# Altium project FLEXI_HAL_Quark.PrjPCB (part 1 of 5)
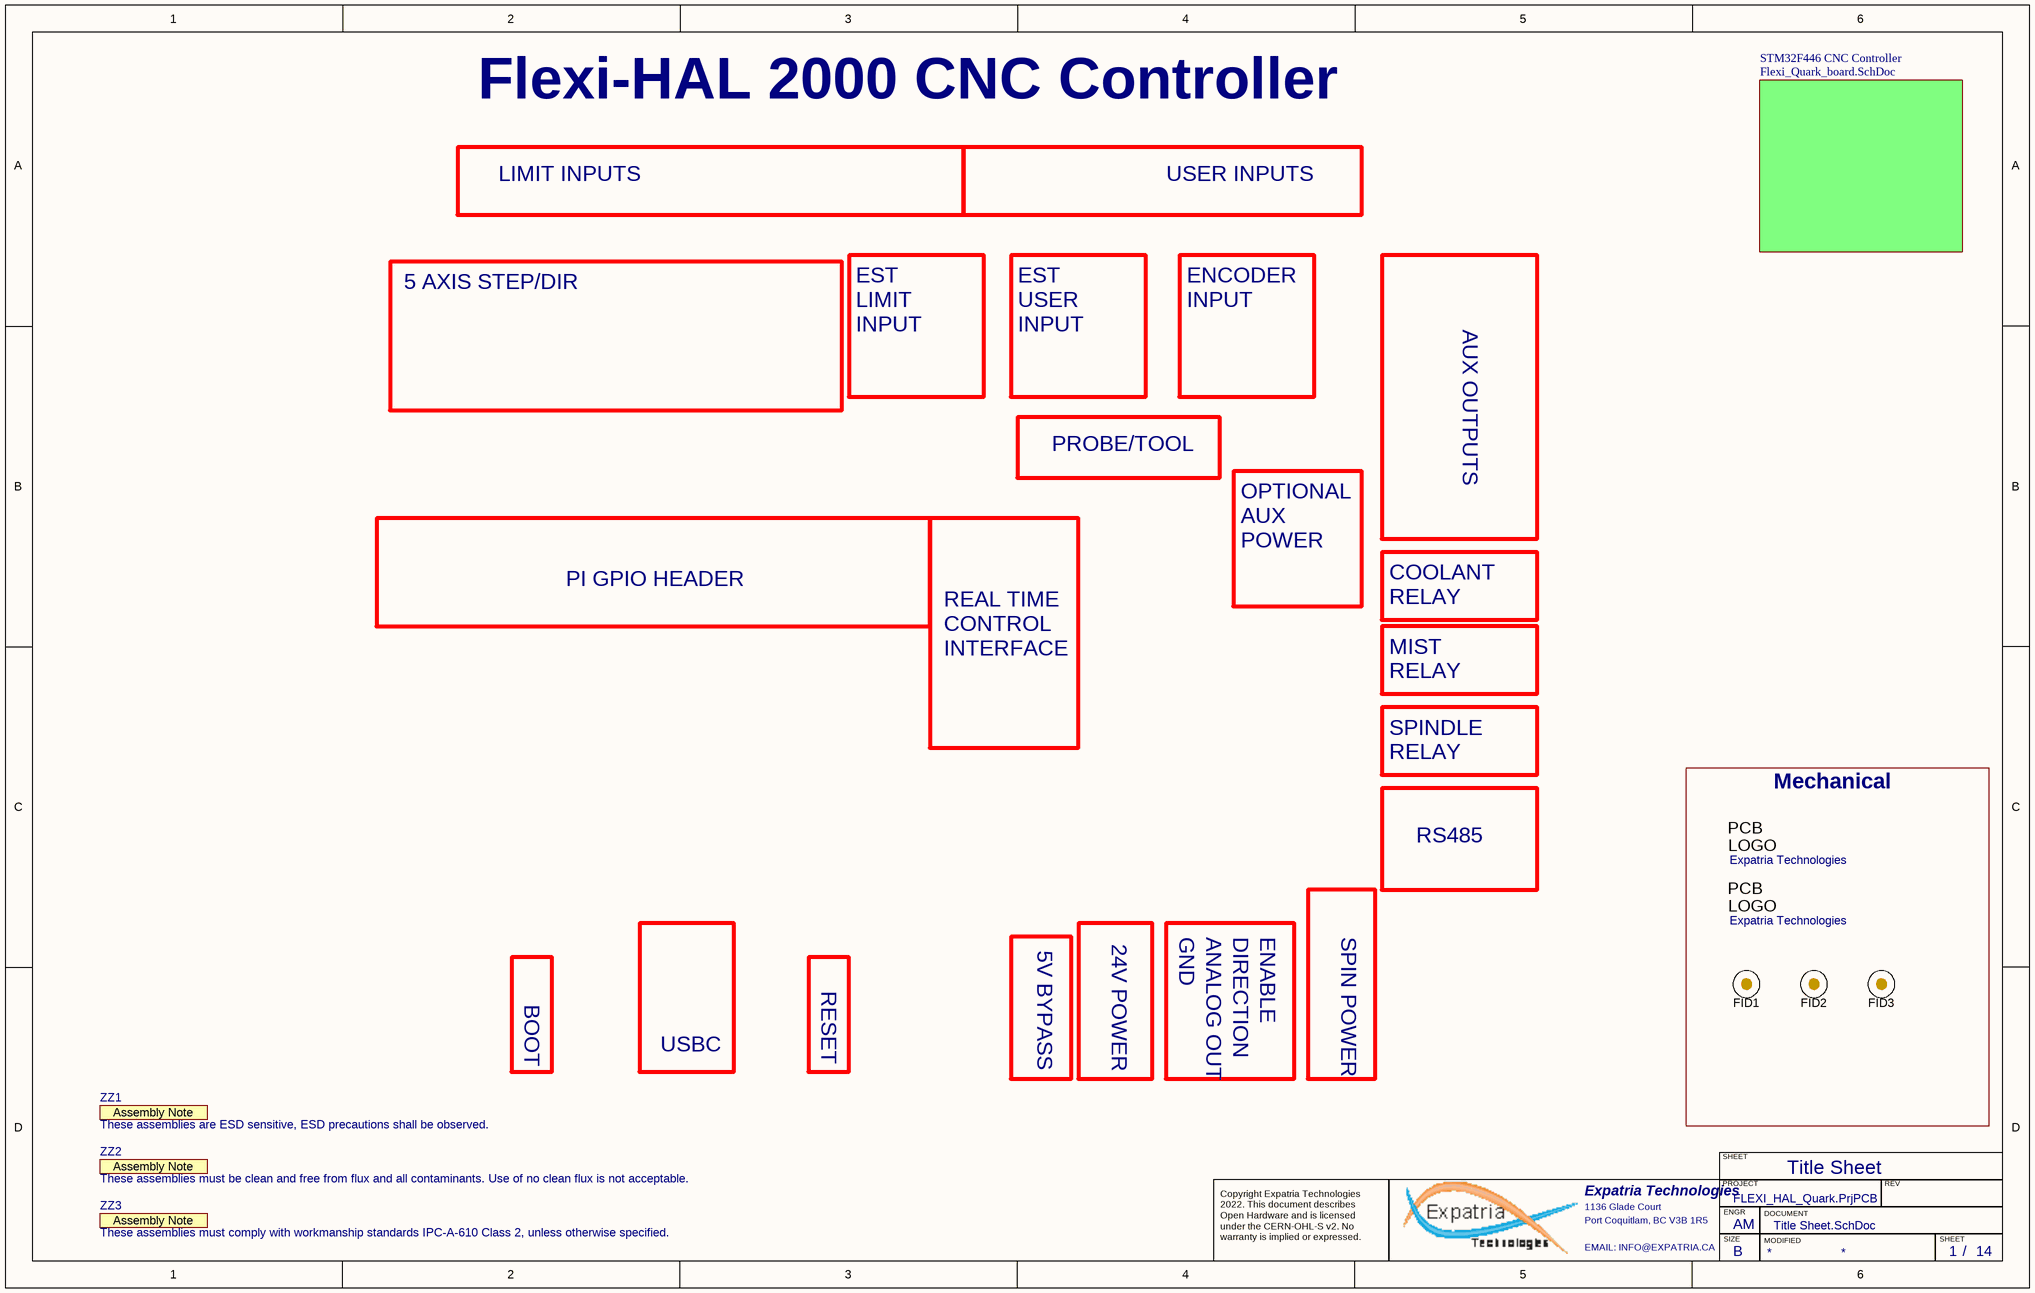
[diagram p0: Title Sheet.SchDoc]
PCBPARTNO: FlexiHAL-STP; PCBREVNO: A1; Title: FlexiHAL-STP; VarRevNo: A1
22 sheets, 771 parts. Net scope: hierarchical (ports join the sheet entries above them; power ports are global).
Board file: FLEXI_HAL_Quark.pcbdoc
Sheets:
  Title Sheet.SchDoc
    STM32F446 CNC Controller = Flexi_Quark_board.SchDoc
      ST = Stepper_driver_group.SchDoc
        SX = Stepper_Driver_Quark.SchDoc
        SY = Stepper_Driver_Quark.SchDoc
        SZ = Stepper_Driver_Quark.SchDoc
        SA = Stepper_Driver_Quark.SchDoc
        SB = Stepper_Driver_Quark.SchDoc
        SC = Stepper_Driver_Quark.SchDoc
        AO = 2CH_Digital_Isolator.SchDoc
        AO = 2CH_Digital_Isolator.SchDoc
      MODBUS = RS485.SchDoc
        RS = 2DIR_Digital_Isolator.SchDoc
      Microcontroller = MCU_STM32H723ZGT6.SchDoc
        Ethernet = Ethernet_Interface.SchDoc
        USB ULPI = USB_ULPI_Interface.SchDoc
      5V_Supply = 5V_Power_Supply.SchDoc
      12V_Supply = 12V_Power_Supply.SchDoc
      Pendant RT Interface = CANBUS_Pendant.SchDoc
        CB = 2DIR_Digital_Isolator.SchDoc
      4 Encoder Inputs = Encoder_Input.SchDoc
        U_ENC0 = Encoder_RJ45.SchDoc
        U_ENC1 = Encoder_RJ45.SchDoc
        U_ENC2 = Encoder_RJ45.SchDoc
        U_ENC3 = Encoder_RJ45.SchDoc
        EI = 2CH_Digital_Isolator.SchDoc
        EI = 2CH_Digital_Isolator.SchDoc
        EI = 2CH_Digital_Isolator.SchDoc
        EI = 2CH_Digital_Isolator.SchDoc
        EI = 2CH_Digital_Isolator.SchDoc
        EI = 2CH_Digital_Isolator.SchDoc
      SERIAL_EXP = Serial_Expansion.SchDoc
      Mezzanine Connector = Mezz_connector.SchDoc
        LIM_SW = Limit_Switches.SchDoc
          PH_DR = Photocoupler12Vinput.SchDoc
          PH_DR = Photocoupler12Vinput.SchDoc
          PH_DR = Photocoupler12Vinput.SchDoc
          PH_DR = Photocoupler12Vinput.SchDoc
          PH_DR = Photocoupler12Vinput.SchDoc
          PH_DR = Photocoupler12Vinput.SchDoc
        USR_SW = Misc_switches.SchDoc
          PH_CY = Photocoupler12Vinput.SchDoc
          PH_FD = Photocoupler12Vinput.SchDoc
          PH_DR = Photocoupler12Vinput.SchDoc
          PH_TL = Photocoupler12Vinput.SchDoc
          PH_PR = Photocoupler12Vinput.SchDoc
        AUX_I = Aux_Inputs.SchDoc
          AI = 2CH_Digital_Isolator.SchDoc
          AI = 2CH_Digital_Isolator.SchDoc
        MZ = 2CH_Digital_Isolator.SchDoc
        MZ = 2CH_Digital_Isolator.SchDoc
        MZ = 2CH_Digital_Isolator.SchDoc
        MZ = 2CH_Digital_Isolator.SchDoc
        MZ = 2CH_Digital_Isolator.SchDoc
        MZ = 2CH_Digital_Isolator.SchDoc
      PH_HLT = 2xparallelswitch_HALT.SchDoc

## Sheet Title Sheet.SchDoc: STM32F446 CNC
size B; Author: AM; CompanyName: Expatria Technologies; DrawnBy: A.Marles; Engineer: AM; Organization: Expatria Technolgoies; DocumentNumber: 1; Revision: A1; SheetNumber: 1; SheetTotal: 14

### Parts
FID1  Fiducial  [Fiducial10-20]  (value not drawn)  (no BOM)
FID2  Fiducial  [Fiducial10-20]  (value not drawn)  (no BOM)
FID3  Fiducial  [Fiducial10-20]  (value not drawn)  (no BOM)
Logo1  Expatria Technologies  [Expatria-Logo]  (no BOM)
Logo2  Expatria Technologies  [Expatria-Logo]  (no BOM)
ZZ1  These assemblies are ESD sensitive, ESD precautions shall be observed.  [AssemblyNote]  (graphical)
ZZ2  These assemblies must be clean and free from flux and all contaminants. Use of no clean flux is not acceptable.  [AssemblyNote]  (graphical)
ZZ3  These assemblies must comply with workmanship standards IPC-A-610 Class 2, unless otherwise specified.  [AssemblyNote]  (graphical)

### Blocks framed on the sheet
Mechanical: FID1-FID3 Logo1 Logo2

### Sub-sheets
STM32F446 CNC Controller = Flexi_Quark_board.SchDoc: no entries

### Notes on the sheet
- Flexi-HAL 2000 CNC Controller
- LIMIT INPUTS
- USER INPUTS
- 5 AXIS STEP/DIR
- EST
  LIMIT
  INPUT
- EST
  USER
  INPUT
- ENCODER
  INPUT
- AUX OUTPUTS
- PROBE/TOOL
- OPTIONAL
  AUX
  POWER
- PI GPIO HEADER
- COOLANT
  RELAY
- MIST
  RELAY
- SPINDLE
  RELAY
- REAL TIME CONTROL INTERFACE
- RS485
- 5V BYPASS
- 24V POWER
- GND
- ANALOG OUT
- DIRECTION
- ENABLE
- SPIN POWER
- BOOT
- RESET
- USBC
- Title Sheet
- SHEET
- Expatria Technologies
- 1136 Glade Court
- Port Coquitlam, BC V3B 1R5
- PROJECT
- SIZE
- ENGR
- MODIFIED
- DOCUMENT
- REV
- Copyright Expatria Technologies 2022. This document describes Open Hardware and is licensed under the CERN-OHL-S v2. No warranty is implied or expressed.
- EMAIL: INFO@EXPATRIA.CA
- B
- /
- (in symbol AssemblyNote) Assembly Note
- (in symbol SBT-Logo) PCB; LOGO

### Library data of the parts
FID1-FID3 = Fiducial: FIDUCIAL NO ASSEMBLY; Manufacturer 1: NONE; Manufacturer Part Number 1: NONE; Value: Fiducial
Logo1 Logo2 = SBT-Logo: Manufacturer 1: NONE; Value: Expatria Logo; Manufacturer Part Number 1: NONE
ZZ1-ZZ3 = AssemblyNote: SymbolCreator: codlsc; SymbolVersion: 2010-05-18; CompType: AssemblyNote; ClassName: AssemblyNote; Publisher: Texas Instruments; LatestRevisionDate: 2012-06-14; LatestRevisionNote: Initial Version; Alternate Manufacturer: -; Alternate PartNumber: -; Parameter 1: *

## Sheet Flexi_Quark_board.SchDoc: RP2040 CNC
size C; Author: AM; CompanyName: Expatria Technologies; DrawnBy: A.Marles; Engineer: AM; Organization: Expatria Technolgoies; Address1: Schematic; DocumentNumber: 2; Revision: A1; SheetNumber: 2; SheetTotal: 14
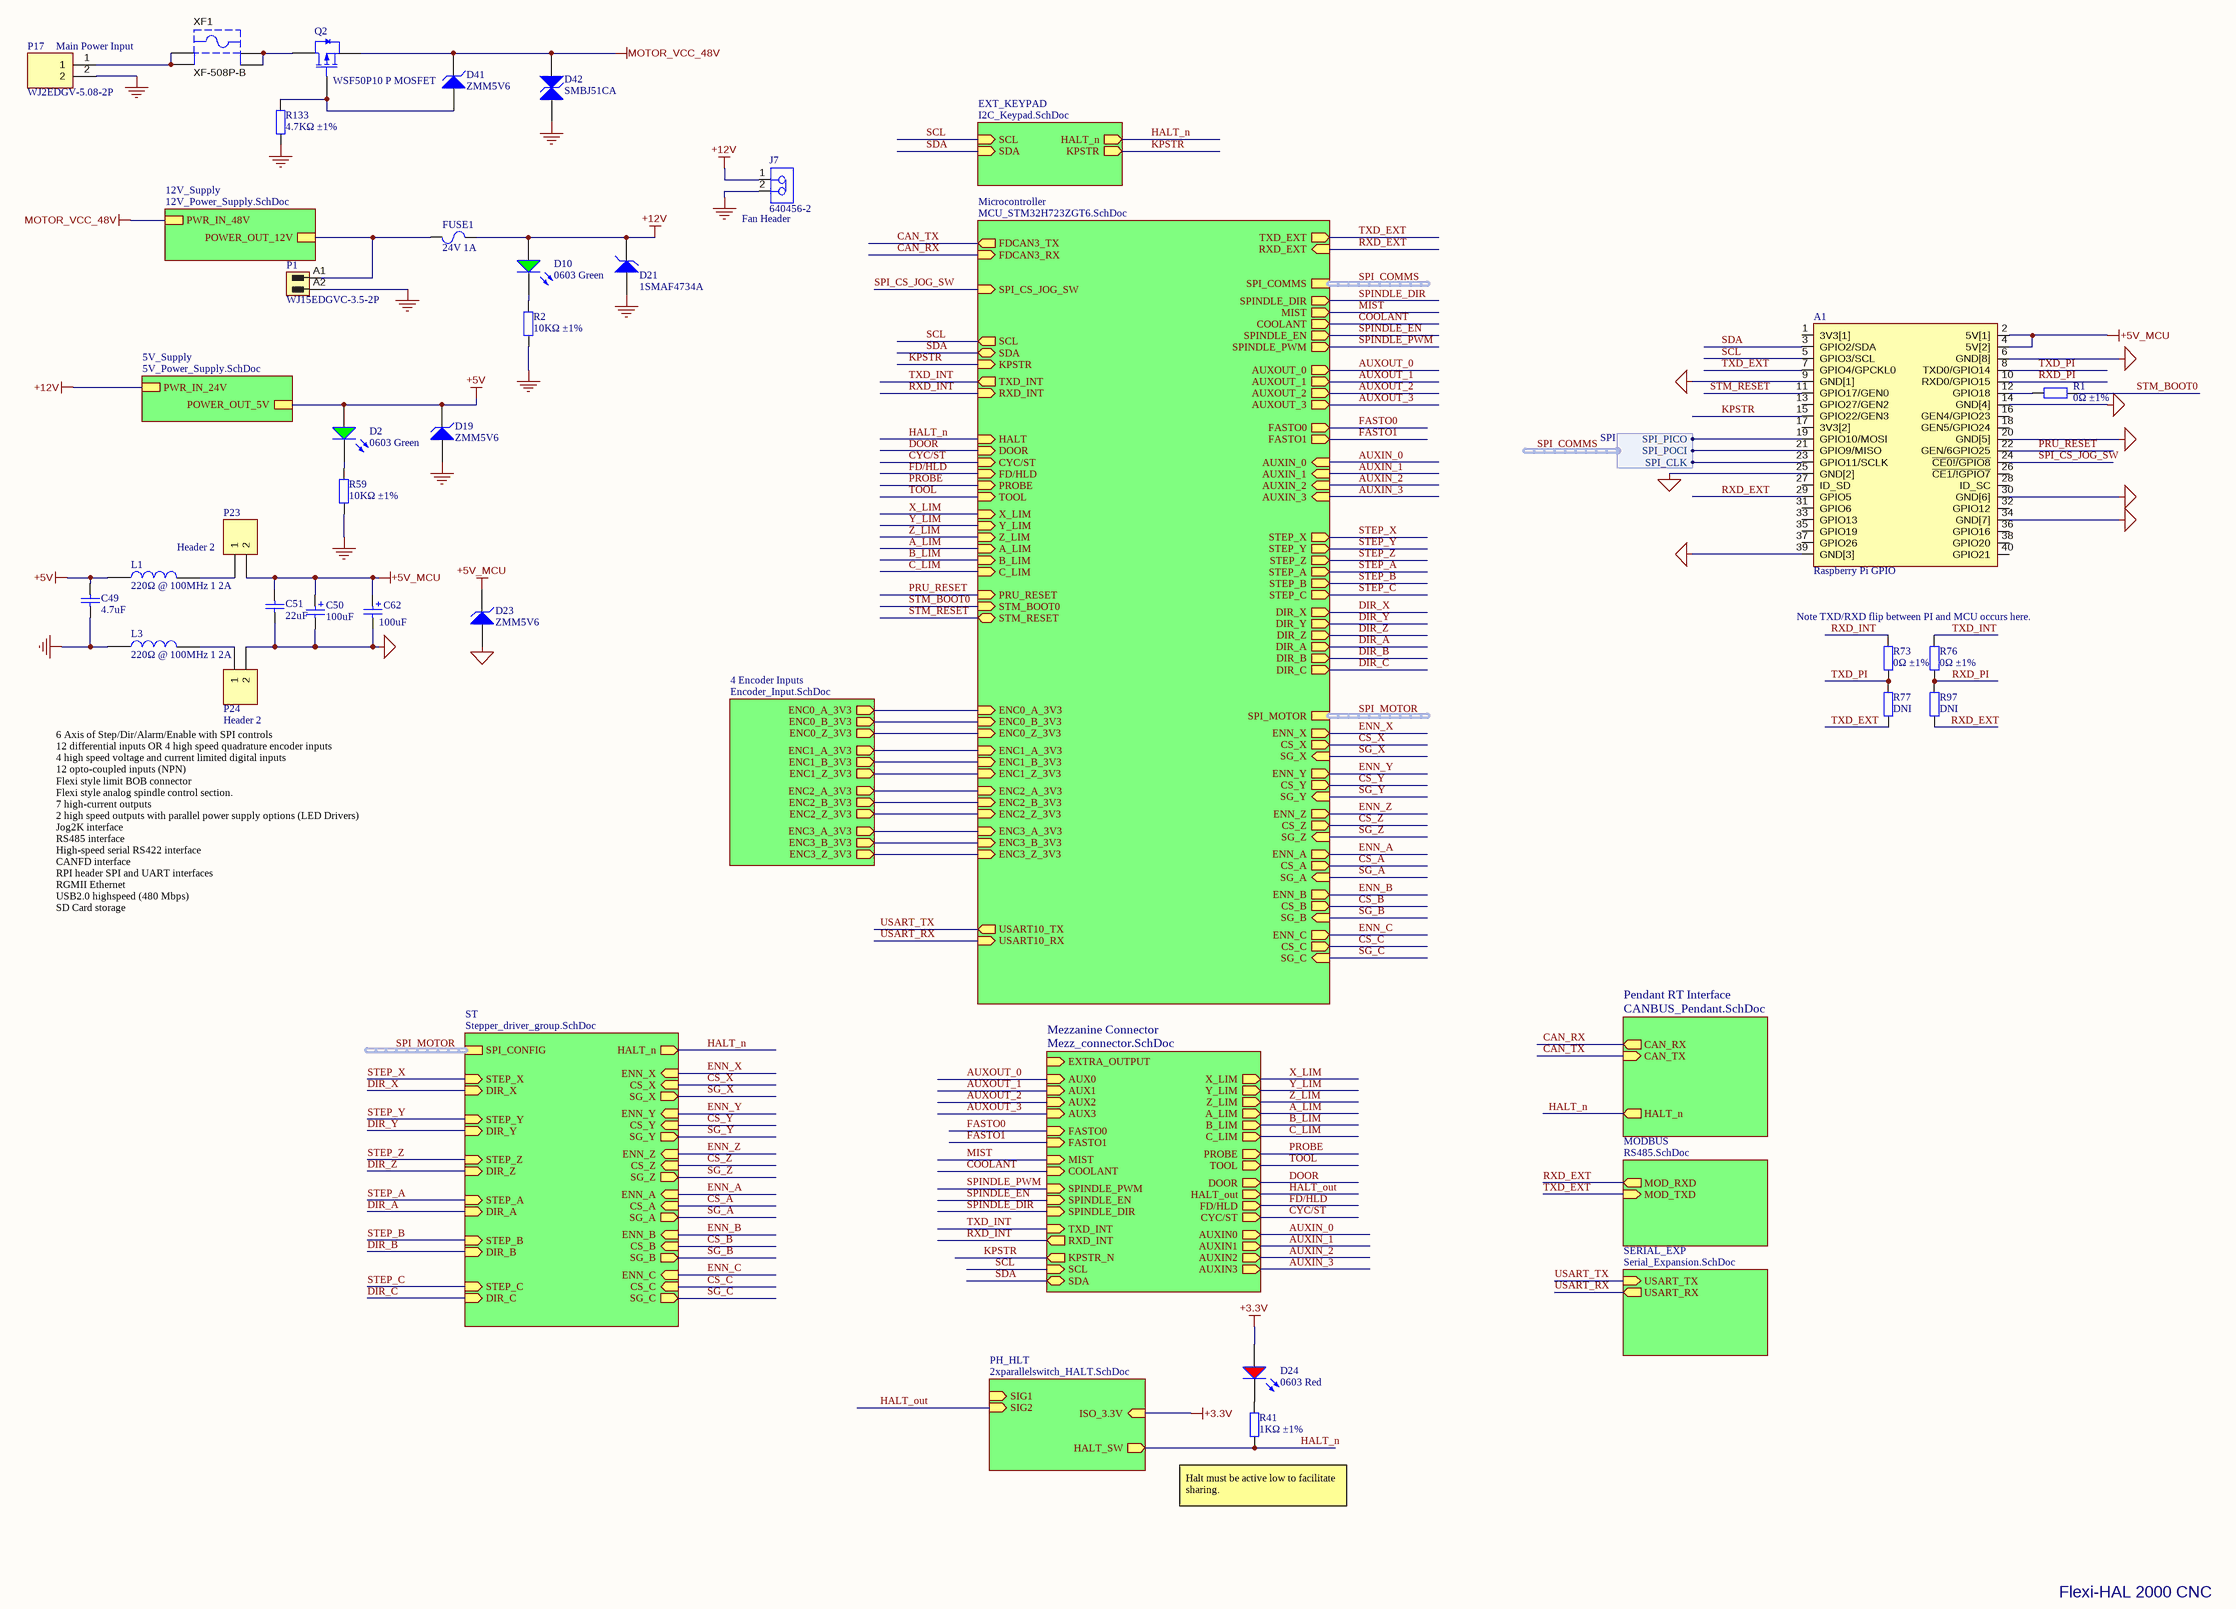
[diagram p1: Flexi_Quark_board.SchDoc]

### Parts
A1  Raspberry Pi GPIO  [MODULE_RASPBERRY_PI_4_MODEL_B]
C49  4.7uF  [0603_C]
C50  100uF  [CASE-B_3528]
C51  22uF  [0805_C]
C62  100uF  [WCAP-ASLI_D6.3H7.7]
D2  0603 Green  [0603_LED_S1]
D10  0603 Green  [0603_LED_S1]
D19  ZMM5V6  [LL-34]
D21  1SMAF4734A  [DIOM5226X240N]
D23  ZMM5V6  [LL-34]
D24  0603 Red  [0603_LED_S1]
D41  ZMM5V6  [LL-34]
D42  SMBJ51CA  [SMB(DO-214AA)_S1]
FUSE1  24V 1A  [1206_C]
J7  640456-2  [TECO-640456-2_V]
L1  220Ω @ 100MHz 1 2A  [0805_C]
L3  220Ω @ 100MHz 1 2A  [0805_C]
P1  WJ15EDGVC-3.5-2P  [691321100002]
P17  WJ2EDGV-5.08-2P  [WJ2EDGV5082P]
P23  Header 2  [HDR1X2]
P24  Header 2  [HDR1X2]
Q2  WSF50P10 P MOSFET  [TO-252-2-180]
R1  0Ω ±1%  [0603_R]
R2  10KΩ ±1%  [0603_R]
R41  1KΩ ±1%  [0603_R]
R59  10KΩ ±1%  [0603_R]
R73  0Ω ±1%  [0402_R]
R76  0Ω ±1%  [0402_R]
R77  DNI  [0402_R]  (no BOM)
R97  DNI  [0402_R]  (no BOM)
R133  4.7KΩ ±1%  [0603_R]
XF1  XF-508P-B  [KSTN-3568_V]

### Sub-sheets
4 Encoder Inputs = Encoder_Input.SchDoc: ENC0_B_3V3 (out), ENC1_Z_3V3 (out), ENC0_Z_3V3 (out), ENC2_Z_3V3 (out), ENC3_Z_3V3 (out), ENC1_B_3V3 (out), ENC0_A_3V3 (out), ENC1_A_3V3 (out), ENC3_A_3V3 (out), ENC3_B_3V3 (out), ENC2_B_3V3 (out), ENC2_A_3V3 (out)
5V_Supply = 5V_Power_Supply.SchDoc: POWER_OUT_5V, PWR_IN_24V
12V_Supply = 12V_Power_Supply.SchDoc: POWER_OUT_12V, PWR_IN_48V
EXT_KEYPAD = I2C_Keypad.SchDoc (file not in this document): HALT_n (out), SCL (in), KPSTR (out), SDA (in)
Mezzanine Connector = Mezz_connector.SchDoc: Y_LIM (out), Z_LIM (out), X_LIM (out), A_LIM (out), B_LIM (out), C_LIM (out), PROBE (out), TOOL (out), FD/HLD (out), CYC/ST (out), HALT_out (out), DOOR (out), AUXIN3 (out), AUXIN0 (out), AUXIN1 (out), AUXIN2 (out), AUX3 (in), AUX0 (in), AUX1 (in), AUX2 (in), SPINDLE_EN (in), SPINDLE_DIR (in), SPINDLE_PWM (in), COOLANT (in), MIST (in), FASTO1 (in), FASTO0 (in), SCL (in), SDA (bidir), KPSTR_N (out), TXD_INT (in), RXD_INT (out), EXTRA_OUTPUT (in)
Microcontroller = MCU_STM32H723ZGT6.SchDoc: RXD_INT (in), TXD_INT (out), SPINDLE_PWM (out), FD/HLD (in), CYC/ST (in), SPI_CS_JOG_SW (in), PROBE (in), TXD_EXT (out), SDA (bidir), A_LIM (in), SCL (out), KPSTR (in), RXD_EXT (in), SPINDLE_EN (out), HALT (in), PRU_RESET (in), X_LIM (in), Z_LIM (in), STM_BOOT0 (in), Y_LIM (in), B_LIM (in), DOOR (in), STM_RESET (bidir), AUXOUT_0 (out), AUXOUT_1 (out), AUXOUT_3 (out), AUXOUT_2 (out), ENC0_B_3V3 (in), ENC1_Z_3V3 (in), ENC0_Z_3V3 (in), ENC2_Z_3V3 (in), ENC3_Z_3V3 (in), ENC1_B_3V3 (in), ENC0_A_3V3 (in), ENC1_A_3V3 (in), ENC3_A_3V3 (in), ENC3_B_3V3 (in), ENC2_B_3V3 (in), ENC2_A_3V3 (in), SPINDLE_DIR (out), COOLANT (out), MIST (out), TOOL (in), SG_Y (in), CS_A (out), SG_Z (in), SG_X (in), ENN_A (out), CS_X (out), ENN_B (out), SG_B (in), CS_B (out), CS_Y (out), SG_A (in), ENN_Y (out), CS_Z (out), ENN_Z (out), ENN_X (out), ENN_C (out), SG_C (in), CS_C (out), DIR_B (out), DIR_Y (out), DIR_X (out), STEP_B (out), STEP_A (out), STEP_Z (out), STEP_Y (out), STEP_X (out), DIR_Z (out), DIR_A (out), STEP_C (out), DIR_C (out), AUXIN_0 (in), AUXIN_1 (in), AUXIN_2 (in), AUXIN_3 (in), SPI_COMMS (harness SPI), FDCAN3_TX (out), SPI_MOTOR (harness SPI), FDCAN3_RX (in), USART10_TX (out), USART10_RX (in), C_LIM (in), FASTO1 (out), FASTO0 (out)
MODBUS = RS485.SchDoc: MOD_TXD (in), MOD_RXD (out)
Pendant RT Interface = CANBUS_Pendant.SchDoc: HALT_n (out), CAN_RX (out), CAN_TX (in)
PH_HLT = 2xparallelswitch_HALT.SchDoc: ISO_3.3V (in), SIG1 (in), SIG2 (in), HALT_SW (out)
SERIAL_EXP = Serial_Expansion.SchDoc: USART_TX (in), USART_RX (out)
ST = Stepper_driver_group.SchDoc: STEP_Z (in), DIR_Z (in), STEP_X (in), STEP_B (in), DIR_X (in), DIR_A (in), DIR_Y (in), STEP_Y (in), DIR_B (in), STEP_A (in), SG_Y (out), CS_A (in), SG_Z (out), SG_X (out), ENN_A (in), CS_X (in), ENN_B (in), SG_B (out), CS_B (in), CS_Y (in), SG_A (out), ENN_Y (in), CS_Z (in), SPI_CONFIG (harness SPI), ENN_Z (in), ENN_X (in), STEP_C (in), DIR_C (in), ENN_C (in), SG_C (out), CS_C (in), HALT_n (out)

### Harnesses
SPI: SPI_CLK, SPI_PICO, SPI_POCI

### Nets
+3.3V: D24.A ; sheet PH_HLT/ISO_3.3V
+5V: C49.2 D2.A D19.2(K) L1.1 ; sheet 5V_Supply/POWER_OUT_5V
+5V_MCU: A1.2(5V[1]) A1.4(5V[2]) C50.1 C51.2 C62.1(P) D23.2(K) P23.2
+12V: D10.A D21.2(K) FUSE1.2 J7.1 ; sheet 5V_Supply/PWR_IN_24V
GND: C49.1 D19.1(A) D21.1(A) D42.1(A) J7.2 L3.1 P1.A2 P17.2 R2.1 R59.1 R133.1
MCU_GND: A1.6(GND[8]) A1.9(GND[1]) A1.14(GND[4]) A1.20(GND[5]) A1.25(GND[2]) A1.30(GND[6]) A1.34(GND[7]) A1.39(GND[3]) C50.2 C51.1 C62.2(N) D23.1(A) P24.2
MOTOR_VCC_48V: D41.2(K) D42.2(K) Q2.2(S) ; sheet 12V_Supply/PWR_IN_48V
A_LIM: sheet Microcontroller/A_LIM, sheet Mezzanine Connector/A_LIM
AUXIN_0: sheet Microcontroller/AUXIN_0, sheet Mezzanine Connector/AUXIN0
AUXIN_1: sheet Microcontroller/AUXIN_1, sheet Mezzanine Connector/AUXIN1
AUXIN_2: sheet Microcontroller/AUXIN_2, sheet Mezzanine Connector/AUXIN2
AUXIN_3: sheet Microcontroller/AUXIN_3, sheet Mezzanine Connector/AUXIN3
AUXOUT_0: sheet Microcontroller/AUXOUT_0, sheet Mezzanine Connector/AUX0
AUXOUT_1: sheet Microcontroller/AUXOUT_1, sheet Mezzanine Connector/AUX1
AUXOUT_2: sheet Microcontroller/AUXOUT_2, sheet Mezzanine Connector/AUX2
AUXOUT_3: sheet Microcontroller/AUXOUT_3, sheet Mezzanine Connector/AUX3
B_LIM: sheet Microcontroller/B_LIM, sheet Mezzanine Connector/B_LIM
C_LIM: sheet Microcontroller/C_LIM, sheet Mezzanine Connector/C_LIM
CAN_RX: sheet Microcontroller/FDCAN3_RX, sheet Pendant RT Interface/CAN_RX
CAN_TX: sheet Microcontroller/FDCAN3_TX, sheet Pendant RT Interface/CAN_TX
COOLANT: sheet Microcontroller/COOLANT, sheet Mezzanine Connector/COOLANT
CS_A: sheet ST/CS_A, sheet Microcontroller/CS_A
CS_B: sheet ST/CS_B, sheet Microcontroller/CS_B
CS_C: sheet ST/CS_C, sheet Microcontroller/CS_C
CS_X: sheet ST/CS_X, sheet Microcontroller/CS_X
CS_Y: sheet ST/CS_Y, sheet Microcontroller/CS_Y
CS_Z: sheet ST/CS_Z, sheet Microcontroller/CS_Z
CYC/ST: sheet Microcontroller/CYC/ST, sheet Mezzanine Connector/CYC/ST
DIR_A: sheet ST/DIR_A, sheet Microcontroller/DIR_A
DIR_B: sheet ST/DIR_B, sheet Microcontroller/DIR_B
DIR_C: sheet ST/DIR_C, sheet Microcontroller/DIR_C
DIR_X: sheet ST/DIR_X, sheet Microcontroller/DIR_X
DIR_Y: sheet ST/DIR_Y, sheet Microcontroller/DIR_Y
DIR_Z: sheet ST/DIR_Z, sheet Microcontroller/DIR_Z
DOOR: sheet Microcontroller/DOOR, sheet Mezzanine Connector/DOOR
ENC0_A_3V3: sheet Microcontroller/ENC0_A_3V3, sheet 4 Encoder Inputs/ENC0_A_3V3
ENC0_B_3V3: sheet Microcontroller/ENC0_B_3V3, sheet 4 Encoder Inputs/ENC0_B_3V3
ENC0_Z_3V3: sheet Microcontroller/ENC0_Z_3V3, sheet 4 Encoder Inputs/ENC0_Z_3V3
ENC1_A_3V3: sheet Microcontroller/ENC1_A_3V3, sheet 4 Encoder Inputs/ENC1_A_3V3
ENC1_B_3V3: sheet Microcontroller/ENC1_B_3V3, sheet 4 Encoder Inputs/ENC1_B_3V3
ENC1_Z_3V3: sheet Microcontroller/ENC1_Z_3V3, sheet 4 Encoder Inputs/ENC1_Z_3V3
ENC2_A_3V3: sheet Microcontroller/ENC2_A_3V3, sheet 4 Encoder Inputs/ENC2_A_3V3
ENC2_B_3V3: sheet Microcontroller/ENC2_B_3V3, sheet 4 Encoder Inputs/ENC2_B_3V3
ENC2_Z_3V3: sheet Microcontroller/ENC2_Z_3V3, sheet 4 Encoder Inputs/ENC2_Z_3V3
ENC3_A_3V3: sheet Microcontroller/ENC3_A_3V3, sheet 4 Encoder Inputs/ENC3_A_3V3
ENC3_B_3V3: sheet Microcontroller/ENC3_B_3V3, sheet 4 Encoder Inputs/ENC3_B_3V3
ENC3_Z_3V3: sheet Microcontroller/ENC3_Z_3V3, sheet 4 Encoder Inputs/ENC3_Z_3V3
ENN_A: sheet ST/ENN_A, sheet Microcontroller/ENN_A
ENN_B: sheet ST/ENN_B, sheet Microcontroller/ENN_B
ENN_C: sheet ST/ENN_C, sheet Microcontroller/ENN_C
ENN_X: sheet ST/ENN_X, sheet Microcontroller/ENN_X
ENN_Y: sheet ST/ENN_Y, sheet Microcontroller/ENN_Y
ENN_Z: sheet ST/ENN_Z, sheet Microcontroller/ENN_Z
FASTO0: sheet Microcontroller/FASTO0, sheet Mezzanine Connector/FASTO0
FASTO1: sheet Microcontroller/FASTO1, sheet Mezzanine Connector/FASTO1
FD/HLD: sheet Microcontroller/FD/HLD, sheet Mezzanine Connector/FD/HLD
HALT_n: R41.2 ; sheet ST/HALT_n, sheet EXT_KEYPAD/HALT_n, sheet Microcontroller/HALT, sheet Pendant RT Interface/HALT_n, sheet PH_HLT/HALT_SW
HALT_out: sheet Mezzanine Connector/HALT_out, sheet PH_HLT/SIG2
KPSTR: A1.15(GPIO22/GEN3) ; sheet EXT_KEYPAD/KPSTR, sheet Microcontroller/KPSTR, sheet Mezzanine Connector/KPSTR_N
MIST: sheet Microcontroller/MIST, sheet Mezzanine Connector/MIST
POWER_OUT_12V: FUSE1.1 P1.A1 ; sheet 12V_Supply/POWER_OUT_12V
PROBE: sheet Microcontroller/PROBE, sheet Mezzanine Connector/PROBE
PRU_RESET: A1.22(GEN/6GPIO25) ; sheet Microcontroller/PRU_RESET
RXD_EXT: A1.29(GPIO5) R97.1 ; sheet MODBUS/MOD_RXD, sheet Microcontroller/RXD_EXT
RXD_INT: R73.2 ; sheet Microcontroller/RXD_INT, sheet Mezzanine Connector/RXD_INT
RXD_PI: A1.10(RXD0/GPIO15) R76.1 R97.2
SCL: A1.5(GPIO3/SCL) ; sheet EXT_KEYPAD/SCL, sheet Microcontroller/SCL, sheet Mezzanine Connector/SCL
SDA: A1.3(GPIO2/SDA) ; sheet EXT_KEYPAD/SDA, sheet Microcontroller/SDA, sheet Mezzanine Connector/SDA
SG_A: sheet ST/SG_A, sheet Microcontroller/SG_A
SG_B: sheet ST/SG_B, sheet Microcontroller/SG_B
SG_C: sheet ST/SG_C, sheet Microcontroller/SG_C
SG_X: sheet ST/SG_X, sheet Microcontroller/SG_X
SG_Y: sheet ST/SG_Y, sheet Microcontroller/SG_Y
SG_Z: sheet ST/SG_Z, sheet Microcontroller/SG_Z
SPI_COMMS.SPI_CLK: A1.23(GPIO11/SCLK) ; sheet Microcontroller/SPI_COMMS.SPI_CLK
SPI_COMMS.SPI_PICO: A1.19(GPIO10/MOSI) ; sheet Microcontroller/SPI_COMMS.SPI_PICO
SPI_COMMS.SPI_POCI: A1.21(GPIO9/MISO) ; sheet Microcontroller/SPI_COMMS.SPI_POCI
SPI_CS_JOG_SW: A1.24(~{CE0!/GPIO8}) ; sheet Microcontroller/SPI_CS_JOG_SW
SPINDLE_DIR: sheet Microcontroller/SPINDLE_DIR, sheet Mezzanine Connector/SPINDLE_DIR
SPINDLE_EN: sheet Microcontroller/SPINDLE_EN, sheet Mezzanine Connector/SPINDLE_EN
SPINDLE_PWM: sheet Microcontroller/SPINDLE_PWM, sheet Mezzanine Connector/SPINDLE_PWM
STEP_A: sheet ST/STEP_A, sheet Microcontroller/STEP_A
STEP_B: sheet ST/STEP_B, sheet Microcontroller/STEP_B
STEP_C: sheet ST/STEP_C, sheet Microcontroller/STEP_C
STEP_X: sheet ST/STEP_X, sheet Microcontroller/STEP_X
STEP_Y: sheet ST/STEP_Y, sheet Microcontroller/STEP_Y
STEP_Z: sheet ST/STEP_Z, sheet Microcontroller/STEP_Z
STM_BOOT0: R1.1 ; sheet Microcontroller/STM_BOOT0
STM_RESET: A1.11(GPIO17/GEN0) ; sheet Microcontroller/STM_RESET
TOOL: sheet Microcontroller/TOOL, sheet Mezzanine Connector/TOOL
TXD_EXT: A1.7(GPIO4/GPCKL0) R77.1 ; sheet MODBUS/MOD_TXD, sheet Microcontroller/TXD_EXT
TXD_INT: R76.2 ; sheet Microcontroller/TXD_INT, sheet Mezzanine Connector/TXD_INT
TXD_PI: A1.8(TXD0/GPIO14) R73.1 R77.2
USART_RX: sheet Microcontroller/USART10_RX, sheet SERIAL_EXP/USART_RX
USART_TX: sheet Microcontroller/USART10_TX, sheet SERIAL_EXP/USART_TX
X_LIM: sheet Microcontroller/X_LIM, sheet Mezzanine Connector/X_LIM
Y_LIM: sheet Microcontroller/Y_LIM, sheet Mezzanine Connector/Y_LIM
Z_LIM: sheet Microcontroller/Z_LIM, sheet Mezzanine Connector/Z_LIM
NetA1_12: A1.12(GPIO18) R1.2
NetD2_K: D2.K R59.2
NetD10_K: D10.K R2.2
NetD24_K: D24.K R41.1
NetD41_1: D41.1(A) Q2.1(G) R133.2
NetL1_2: L1.2 P23.1
NetL3_2: L3.2 P24.1
NetP17_1: P17.1 XF1.1 XF1.2
NetQ2_3: Q2.3(D) XF1.3 XF1.4

Not connected (* = marked no-connect by the designer): A1 1(3V3[1]) 13(GPIO27/GEN2) 16(GEN4/GPIO23) 17(3V3[2]) 18(GEN5/GPIO24) 26(~{CE1/!GPIO7}) 27(ID_SD) 28(ID_SC) 31(GPIO6) 32(GPIO12) 33(GPIO13) 35(GPIO19) 36(GPIO16) 37(GPIO26) 38(GPIO20) 40(GPIO21)

### Buses and harness runs
harness SPI_COMMS = sheet Microcontroller/SPI_COMMS
harness SPI_MOTOR = sheet Microcontroller/SPI_MOTOR
harness SPI_MOTOR = sheet ST/SPI_CONFIG

### Notes on the sheet
- (near P17) Main Power Input
- (near J7) Fan Header
- Note TXD/RXD flip between PI and MCU occurs here.
- 6 Axis of Step/Dir/Alarm/Enable with SPI controls
  12 differential inputs OR 4 high speed quadrature encoder inputs
  4 high speed voltage and current limited digital inputs
  12 opto-coupled inputs (NPN)
  Flexi style limit BOB connector
  Flexi style analog spindle control section.
  7 high-current outputs
  2 high speed outputs with parallel power supply options (LED Drivers)
  Jog2K interface
  RS485 interface
  High-speed serial RS422 interface
  CANFD interface
  RPI header SPI and UART interfaces
  RGMII Ethernet
  USB2.0 highspeed (480 Mbps)
  SD Card storage
- (near R41) Halt must be active low to facilitate sharing.
- Flexi-HAL 2000 CNC
- Expatria Technologies
- SHEET
- PROJECT
- REV
- 1136 Glade Court
- Port Coquitlam, BC V3B 1R5
- EMAIL: INFO@EXPATRIA.CA
- SIZE
- ENGR
- C
- MODIFIED
- DOCUMENT
- /
- Copyright Expatria Technologies 2022. This document describes Open Hardware and is licensed under the CERN-OHL-S v2. No warranty is implied or expressed.

### Library data of the parts
A1 = ADA3708: Raspberry Pi Zero WH _Zero W with Headers_; MP: DS1023-2*20SF11; MF: CONNFLY Elec; Availability: Unavailable; Package: None; Value: *; Price: None; SuppliersPartNumber: C132132
C49 = 0603 4.7uF (475) 10% 16V: Chip capacitors; Manufacturer: Samsung Electro-Mechanics; PartNumber: CL10A475KO8NNNC; Tolerance: 10%; Voltage: 16V; ComponentLink1Description: Supplier link; ComponentLink1URL: http://www.szlcsc.com/product/details_20375.html; Package: 0603; Supplier: LC; SuppliersPartNumber: C19666; Capacitance: 4.7uF
C50 = 3528 100uF (107) 10% 6.3V: Tantalum capacitor; Manufacturer: AVX; PartNumber: TAJB107K006RNJ; Tolerance: 10%; Voltage: 6.3V; ComponentLink1Description: Supplier link; ComponentLink1URL: http://www.szlcsc.com/product/details_16815.html; Package: 3528; Supplier: LC; SuppliersPartNumber: C16133; Capacitance: 100uF
C51 = 0805 22uF (226) 20% 25V: Chip capacitors; Manufacturer: Samsung Electro-Mechanics; PartNumber: CL21A226MAQNNNE; Tolerance: 20%; Voltage: 25V; ComponentLink1Description: Supplier link; ComponentLink1URL: http://www.szlcsc.com/product/details_46786.html; Package: 0805; Supplier: LC; SuppliersPartNumber: C2922481; Capacitance: 22uF
C62 = 865080445010: -45℃~+105℃ 2000hrs@105℃ 100uF 7.7mm 35V 6.3mm ±20% SMD,6.3x7.7mm Aluminum Electrolytic Capacitors - SMD ROHS; Manufacturer: Capxon International Elec; SuppliersPartNumber: C59934; Value: 100uF
D2 D10 = 0603 LED Green: LED; ComponentLink1Description: 供应商链接; ComponentLink1URL: http://www.szlcsc.com/product/details_73152.html; Package: 0603; Supplier: LC; SuppliersPartNumber: C72043; Color: Green
D19 D23 D41 = LL-34 ZMM5V6: 500mW - 0.1uA @ 1V 5.6V LL-34 Zener Diodes ROHS; ComponentLink1Description: 供应商链接; ComponentLink1URL: http://www.szlcsc.com/product/details_8541.html; Package: LL-34; Supplier: LC; SuppliersPartNumber: C8062
D21 = BZT52C27: 27V ±5% 1W 500nA @ 20.5V SMA(DO-214AC) Zener Diodes RoHS; ComponentLink1Description: 供应商链接; ComponentLink1URL: http://www.szlcsc.com/product/details_8541.html; Package: SMAF; Supplier: LC; SuppliersPartNumber: C169539
D24 = 0603 LED Red: LED; ComponentLink1Description: 供应商链接; ComponentLink1URL: http://www.szlcsc.com/product/details_2659.html; Package: 0603; Supplier: LC; SuppliersPartNumber: C2286; Color: Red
D42 = SMB/DO-214AA P6SMB6.8CA: 82.4V 56.7V 51V SMB(DO-214AA) TVS ROHS; ComponentLink1Description: 供应商链接; ComponentLink1URL: http://www.szlcsc.com/product/details_79530.html; Package: SMB/DO-214AA; Supplier: LC; SuppliersPartNumber: C151265
FUSE1 = JK-nSMD050-24: 24V 1A 0.1s 1206 PTC Resettable Fuses RoHS; Manufacturer: Jinrui Electronic Materials Co.; Package: 1206; Supplier: LC; SuppliersPartNumber: C369160; PartNumber: JK-nSMD050-24
J7 = CMP-2000-05417-1: Male Header, Pitch 2.54 mm, 1 x 2 Position, Height 10.49 mm, Tail Length 3.556 mm, -55 to 105 degC, RoHS, Bulk; Manufacturer: TE Connectivity; Standards: RoHSCompliant,ELVCompliant,UL94V-0; Material, Housing: Polyester; Agency Approvals: CSA,UL; Brand/Series: MTA-100Series; Contact Centerline Spacing: 0.100 / in.; Material, Contact: CopperAlloy; Current, Rating: 5 / A; Color, Housing: White; Contact Termination Area Plating: Tin; Special Features: Pinstrip; Number of Positions: 2; Pin Spacing: 0.1 / "; Temperature, Operating: -55to+105 / degC; Angle: Straight; Mount Angle: Vertical; Connector Type: MTA-100; Primary Type: InterconnectSystem; Voltage, Rating: 250 / V; Mounting Hole Size: 0.04 / "; Number of Rows: 1; Termination: Solder; Length, Terminal Post: 0.14 / in.; Manufacturer URL: http://www.te.com/; Color: White; Size, Post: 0.025 / in.; Contact Shape: Square; Mounting Type: PCMount; Datasheet URL: https://datasheet.ciiva.com/11746/0900766b80eb7fdd-11746365.pdf; Type: PCBPlug; Datasheet Version: Rev. W, 06/2004; Number of Contacts: 2; Flammability Rating: UL94V-0; Contact Plating: Tin; Length, Pin: 0.14 / "; Contact Mating Area Plating: Tin; Length, Overall: 0.2 / "; SuppliersPartNumber: C86502
L1 L3 = 0402 220R@100Mhz 0.1A: 220Ω @ 100MHz 1 2A 150mΩ 0805 Ferrite Beads ROHS; Notepad: *; Package: 0805; Supplier: LC; SuppliersPartNumber: C139188
P1 = 3.5mm Terminal Header 2p: Header,Male Pin,Covered(4 Sided) 2 1 0.138"（3.50mm） 2 P=3.5mm Pluggable System Terminal Block RoHS; Manufacturer: Weidmueller; Manufacturer 1: Weidmuller; Manufacturer Part Number 1: 1604470000; UL_94_flammability_rating: V-0; Pitch_mm: 3.5 mm; Side_termination_characteristic: closed side; Pitch_inch: 0.138 inch; Solder_pin_length_mm: 3.2 mm; Short_text_for_material: SL 3.50/02/180G 3.2SN OR BX; ComponentLink1Description: Manufacturer URL; ComponentLink1URL: http://www.weidmueller.com/; PartNumber: WJ15EDGVC-3.5-2P; Revision: V1; PackageReference: SL_3_50_180G_02; Packaging: Box; SuppliersPartNumber: C192777
P17 = WJ2EDGV-5.08-2P: 5.08mm Green Board Edge/Receptacle-Open Straight,P=5.08mm Pluggable System Terminal Block ROHS; Manufacturer_Name: Ningbo Kangnex; Manufacturer: Kangnex; SuppliersPartNumber: C8461; Datasheet Link: https://datasheet.lcsc.com/szlcsc/1912251635_Ningbo-Kangnex-Elec-WJ2EDGV-5-08-2P_C8461.pdf; Height: 12.4mm; Manufacturer_Part_Number: WJ2EDGV-5.08-2P; Supplier 1: LCSC; Supplier Part Number 1: C8461; Manufacturer Part Number: WJ2EDGV-5.08-2P; RoHS: No
P23 P24 = Header 2: Header, 2-Pin; Publisher: Altium Limited; LatestRevisionDate: 17-Jul-2002; LatestRevisionNote: Re-released for DXP Platform.; SuppliersPartNumber: C234182
Q2 = WSF50P10 P TO-252-2: 100V 34A 32mΩ@10V,18A 96W P Channel TO-252-2 MOSFETs ROHS; ComponentLink1Description: 供应商链接; ComponentLink1URL: http://www.szlcsc.com/product/details_15801.html; Package: TO-252-2; Supplier: LC; SuppliersPartNumber: C2758447
R1 = 0603 0R (0R0) 1%: Chip resistor; Manufacturer: Uniroyal Elec; PartNumber: 0603WAF0000T5E; Power: 1/10W; ComponentLink1Description: Supplier link; ComponentLink1URL: http://www.szlcsc.com/product/details_21903.html; Package: 0603; Supplier: LC; SuppliersPartNumber: C21189; Resistance: 0Ω; Tolerance: 1%
R2 R59 = 0603 10K (1002) 1%: Chip resistor; Manufacturer: Uniroyal Elec; PartNumber: 0603WAF1002T5E; Power: 1/10W; ComponentLink1Description: Supplier link; ComponentLink1URL: http://www.szlcsc.com/product/details_26547.html; Package: 0603; Supplier: LC; SuppliersPartNumber: C25804; Resistance: 10KΩ; Tolerance: 1%
R41 = 0603 1K (1001) 1%: Chip resistor; Manufacturer: Uniroyal Elec; PartNumber: 0603WAF1001T5E; Power: 1/10W; ComponentLink1Description: Supplier link; ComponentLink1URL: http://www.szlcsc.com/product/details_21904.html; Package: 0603; Supplier: LC; SuppliersPartNumber: C21190; Resistance: 1KΩ; Tolerance: 1%
R73 R76 = 0402 0R (0R0) 1%: Chip resistor; Manufacturer: Uniroyal Elec; PartNumber: 0402WGF0000TCE; Power: 1/16W; ComponentLink1Description: Supplier link; ComponentLink1URL: http://www.szlcsc.com/product/details_17853.html; Package: 0402; Supplier: LC; SuppliersPartNumber: C17168; Resistance: 0Ω; Tolerance: 1%
R77 R97 = 0402 0R (0R0) 1%: Chip resistor; Manufacturer: Uniroyal Elec; PartNumber: 0402WGF0000TCE; Power: 1/16W; Resistance: 0Ω; Tolerance: 1%; ComponentLink1Description: Supplier link; ComponentLink1URL: http://www.szlcsc.com/product/details_17853.html; Package: 0402; Supplier: LC; SuppliersPartNumber: C17168
R133 = 0603 4.7K (4701) 1%: Chip resistor; Manufacturer: Uniroyal Elec; PartNumber: 0603WAF4701T5E; Power: 1/10W; ComponentLink1Description: Supplier link; ComponentLink1URL: http://www.szlcsc.com/product/details_23889.html; Package: 0603; Supplier: LC; SuppliersPartNumber: C23162; Resistance: 4.7KΩ; Tolerance: 1%
XF1 = XF-508P-B: Fuse Holder, 20 A, 500 V, -50 to 145 degC, 4-Pin THD, RoHS; Manufacturer: XFCN; Mounting Technology: ThroughHole; Package Description: 4-Pin Through Hole Device, Body 16 x 6.73 mm, Pitch 9.9 mm; SuppliersPartNumber: C2935468; Supplier: LCSC; Manufacturer Part Number: XF-508P-B

## Sheet Stepper_driver_group.SchDoc: STM32F446 CNC
size B; Author: AM; CompanyName: Expatria Technologies; DrawnBy: A.Marles; Engineer: AM; Organization: Expatria Technologies; DocumentNumber: 4; Revision: A1; SheetNumber: 4; SheetTotal: 14
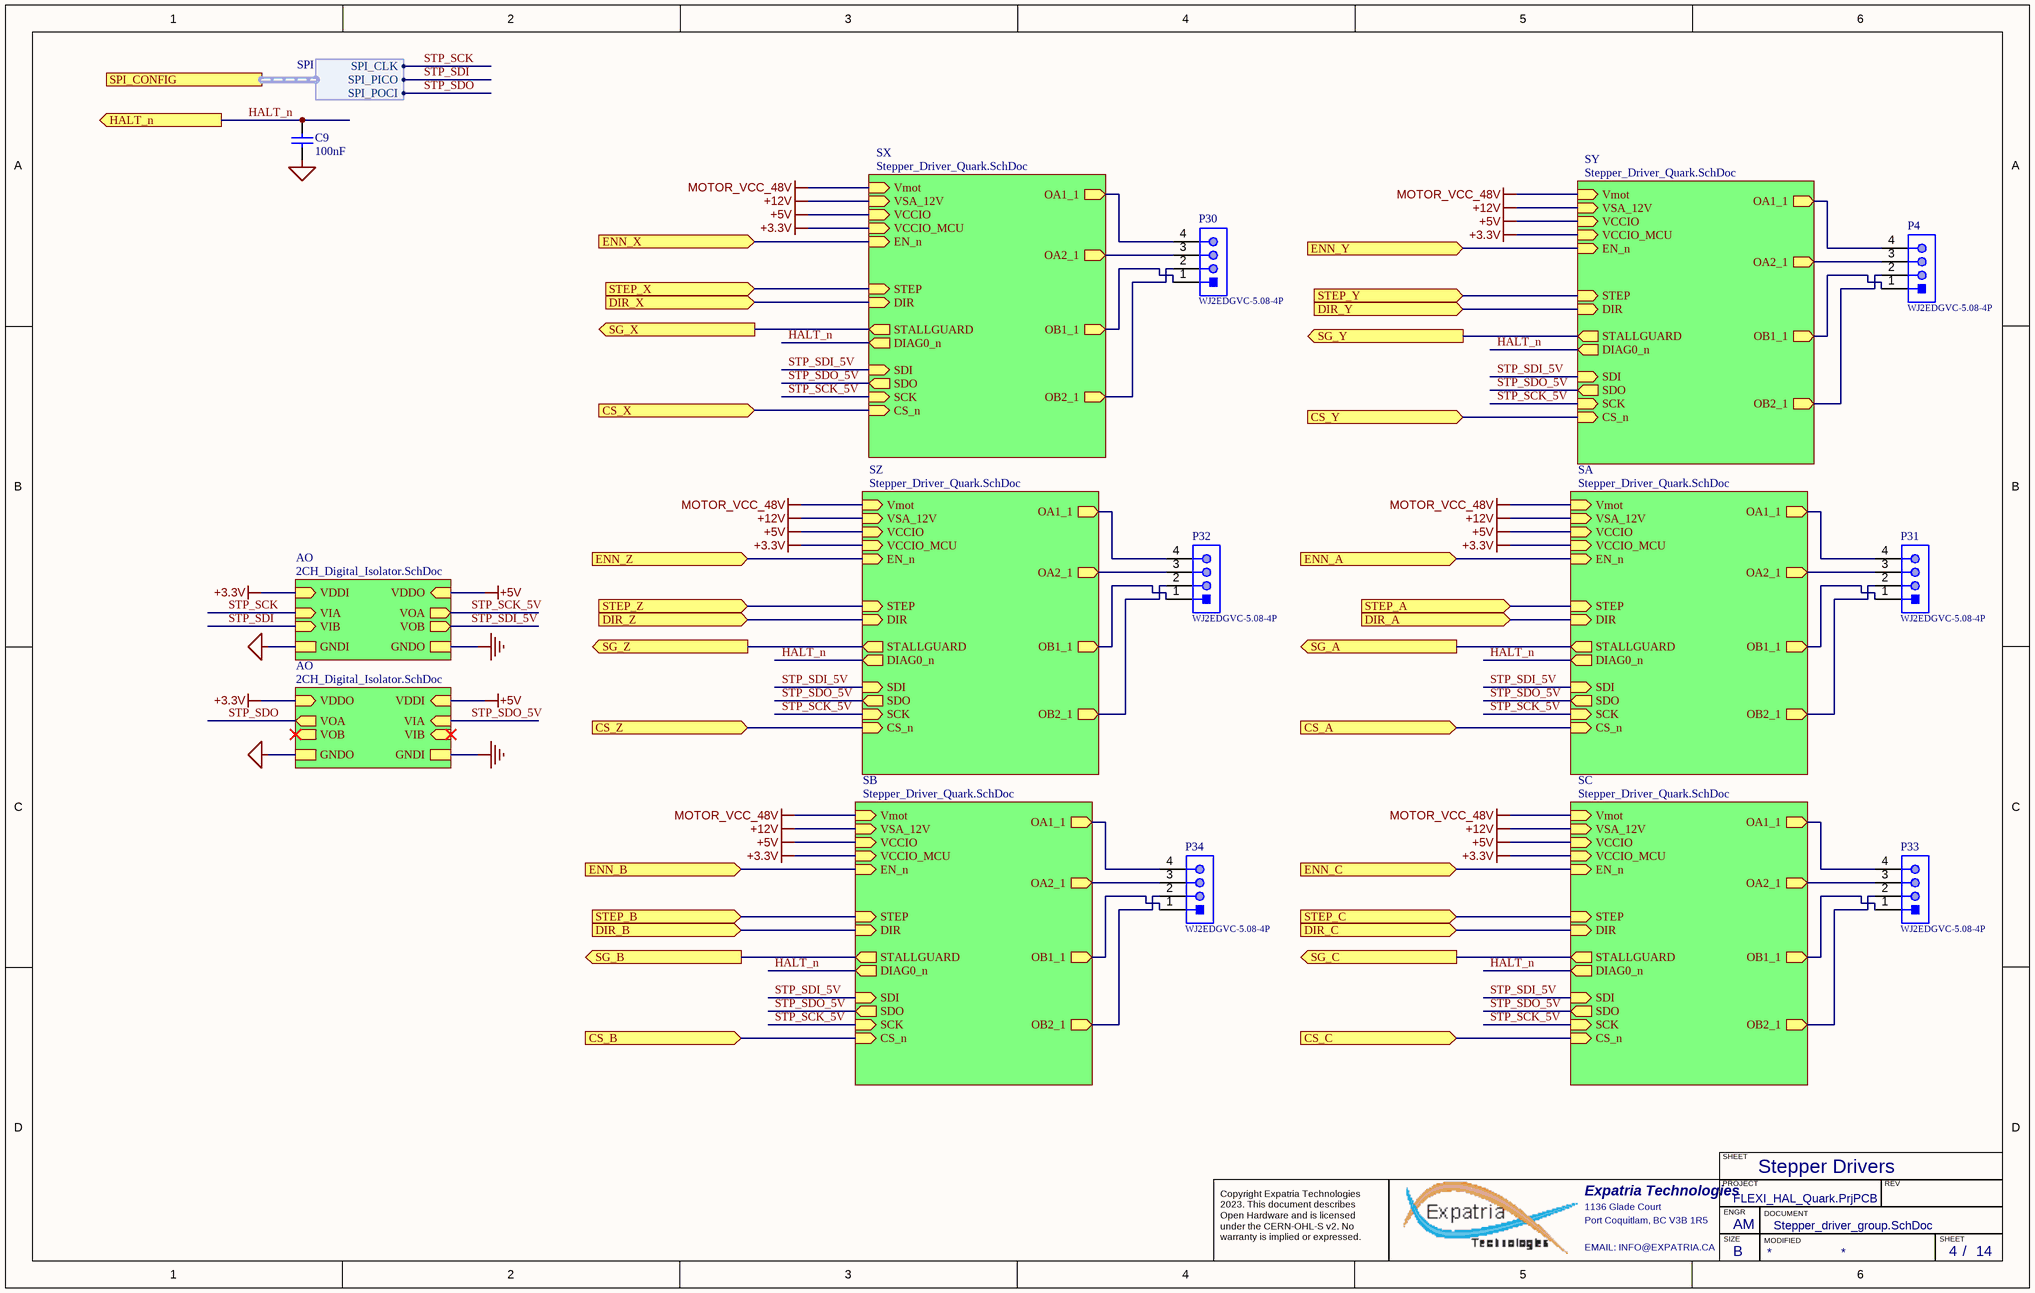
[diagram p2: Stepper_driver_group.SchDoc]

### Parts
C9  100nF  [0603_C]
P4  WJ2EDGVC-5.08-4P  [WJ2EDGVC-5.08-4P]
P30  WJ2EDGVC-5.08-4P  [WJ2EDGVC-5.08-4P]
P31  WJ2EDGVC-5.08-4P  [WJ2EDGVC-5.08-4P]
P32  WJ2EDGVC-5.08-4P  [WJ2EDGVC-5.08-4P]
P33  WJ2EDGVC-5.08-4P  [WJ2EDGVC-5.08-4P]
P34  WJ2EDGVC-5.08-4P  [WJ2EDGVC-5.08-4P]

### Sub-sheets
AO = 2CH_Digital_Isolator.SchDoc: VDDO (in), VIB (in), VIA (in), VOB (out), VOA (out), VDDI (in), GNDO, GNDI
AO = 2CH_Digital_Isolator.SchDoc: VDDO (in), VIB (in), VIA (in), VOB (out), VOA (out), VDDI (in), GNDO, GNDI
SA = Stepper_Driver_Quark.SchDoc: SCK (in), EN_n (in), OB1_1 (out), STEP (in), OB2_1 (out), DIR (in), STALLGUARD (out), SDI (in), SDO (out), OA1_1 (out), OA2_1 (out), CS_n (in), Vmot (in), VSA_12V (in), VCCIO (in), VCCIO_MCU (in), DIAG0_n (out)
SB = Stepper_Driver_Quark.SchDoc: SCK (in), EN_n (in), OB1_1 (out), STEP (in), OB2_1 (out), DIR (in), STALLGUARD (out), SDI (in), SDO (out), OA1_1 (out), OA2_1 (out), CS_n (in), Vmot (in), VSA_12V (in), VCCIO (in), VCCIO_MCU (in), DIAG0_n (out)
SC = Stepper_Driver_Quark.SchDoc: SCK (in), EN_n (in), OB1_1 (out), STEP (in), OB2_1 (out), DIR (in), STALLGUARD (out), SDI (in), SDO (out), OA1_1 (out), OA2_1 (out), CS_n (in), Vmot (in), VSA_12V (in), VCCIO (in), VCCIO_MCU (in), DIAG0_n (out)
SX = Stepper_Driver_Quark.SchDoc: SCK (in), EN_n (in), OB1_1 (out), STEP (in), OB2_1 (out), DIR (in), STALLGUARD (out), SDI (in), SDO (out), OA1_1 (out), OA2_1 (out), CS_n (in), Vmot (in), VSA_12V (in), VCCIO (in), VCCIO_MCU (in), DIAG0_n (out)
SY = Stepper_Driver_Quark.SchDoc: SCK (in), EN_n (in), OB1_1 (out), STEP (in), OB2_1 (out), DIR (in), STALLGUARD (out), SDI (in), OA1_1 (out), OA2_1 (out), CS_n (in), Vmot (in), VSA_12V (in), VCCIO (in), VCCIO_MCU (in), SDO (out), DIAG0_n (out)
SZ = Stepper_Driver_Quark.SchDoc: SCK (in), EN_n (in), OB1_1 (out), STEP (in), OB2_1 (out), DIR (in), STALLGUARD (out), SDI (in), SDO (out), OA1_1 (out), OA2_1 (out), CS_n (in), Vmot (in), VSA_12V (in), VCCIO (in), VCCIO_MCU (in), DIAG0_n (out)

### Ports
CS_A (in), CS_B (in), CS_C (in), CS_X (in), CS_Y (in), CS_Z (in), DIR_A (in), DIR_B (in), DIR_C (in), DIR_X (in), DIR_Y (in), DIR_Z (in), ENN_A (in), ENN_B (in), ENN_C (in), ENN_X (in), ENN_Y (in), ENN_Z (in), HALT_n (out), SG_A (out), SG_B (out), SG_C (out), SG_X (out), SG_Y (out), SG_Z (out), SPI_CONFIG (harness SPI), STEP_A (in), STEP_B (in), STEP_C (in), STEP_X (in), STEP_Y (in), STEP_Z (in)

### Harnesses
SPI: SPI_CLK, SPI_PICO, SPI_POCI

### Nets
+3.3V: sheet SX/VCCIO_MCU, sheet SY/VCCIO_MCU, sheet SZ/VCCIO_MCU, sheet SA/VCCIO_MCU, sheet SB/VCCIO_MCU, sheet SC/VCCIO_MCU, sheet AO/VDDI, sheet AO/VDDO
+5V: sheet SX/VCCIO, sheet SY/VCCIO, sheet SZ/VCCIO, sheet SA/VCCIO, sheet SB/VCCIO, sheet SC/VCCIO, sheet AO/VDDO, sheet AO/VDDI
+12V: sheet SX/VSA_12V, sheet SY/VSA_12V, sheet SZ/VSA_12V, sheet SA/VSA_12V, sheet SB/VSA_12V, sheet SC/VSA_12V
GND: sheet AO/GNDO, sheet AO/GNDI
MCU_GND: C9.2 ; sheet AO/GNDI, sheet AO/GNDO
MOTOR_VCC_48V: sheet SX/Vmot, sheet SY/Vmot, sheet SZ/Vmot, sheet SA/Vmot, sheet SB/Vmot, sheet SC/Vmot
CS_A: port CS_A, sheet SA/CS_n
CS_B: port CS_B, sheet SB/CS_n
CS_C: port CS_C, sheet SC/CS_n
CS_X: port CS_X, sheet SX/CS_n
CS_Y: port CS_Y, sheet SY/CS_n
CS_Z: port CS_Z, sheet SZ/CS_n
DIR_A: port DIR_A, sheet SA/DIR
DIR_B: port DIR_B, sheet SB/DIR
DIR_C: port DIR_C, sheet SC/DIR
DIR_X: port DIR_X, sheet SX/DIR
DIR_Y: port DIR_Y, sheet SY/DIR
DIR_Z: port DIR_Z, sheet SZ/DIR
ENN_A: port ENN_A, sheet SA/EN_n
ENN_B: port ENN_B, sheet SB/EN_n
ENN_C: port ENN_C, sheet SC/EN_n
ENN_X: port ENN_X, sheet SX/EN_n
ENN_Y: port ENN_Y, sheet SY/EN_n
ENN_Z: port ENN_Z, sheet SZ/EN_n
HALT_n: C9.1 ; port HALT_n, sheet SX/DIAG0_n, sheet SY/DIAG0_n, sheet SZ/DIAG0_n, sheet SA/DIAG0_n, sheet SB/DIAG0_n, sheet SC/DIAG0_n
OA1_1: P4.4 ; sheet SY/OA1_1
OA1_1: P30.4 ; sheet SX/OA1_1  [a separate net that carries the same name]
OA1_1: P32.4 ; sheet SZ/OA1_1  [a separate net that carries the same name]
OA1_1: P34.4 ; sheet SB/OA1_1  [a separate net that carries the same name]
OA1_1: P33.4 ; sheet SC/OA1_1  [a separate net that carries the same name]
OA1_1: P31.4 ; sheet SA/OA1_1  [a separate net that carries the same name]
OA2_1: P4.3 ; sheet SY/OA2_1
OA2_1: P30.3 ; sheet SX/OA2_1  [a separate net that carries the same name]
OA2_1: P32.3 ; sheet SZ/OA2_1  [a separate net that carries the same name]
OA2_1: P34.3 ; sheet SB/OA2_1  [a separate net that carries the same name]
OA2_1: P33.3 ; sheet SC/OA2_1  [a separate net that carries the same name]
OA2_1: P31.3 ; sheet SA/OA2_1  [a separate net that carries the same name]
OB1_1: P4.1 ; sheet SY/OB1_1
OB1_1: P30.1 ; sheet SX/OB1_1  [a separate net that carries the same name]
OB1_1: P32.1 ; sheet SZ/OB1_1  [a separate net that carries the same name]
OB1_1: P34.1 ; sheet SB/OB1_1  [a separate net that carries the same name]
OB1_1: P33.1 ; sheet SC/OB1_1  [a separate net that carries the same name]
OB1_1: P31.1 ; sheet SA/OB1_1  [a separate net that carries the same name]
OB2_1: P4.2 ; sheet SY/OB2_1
OB2_1: P30.2 ; sheet SX/OB2_1  [a separate net that carries the same name]
OB2_1: P32.2 ; sheet SZ/OB2_1  [a separate net that carries the same name]
OB2_1: P34.2 ; sheet SB/OB2_1  [a separate net that carries the same name]
OB2_1: P33.2 ; sheet SC/OB2_1  [a separate net that carries the same name]
OB2_1: P31.2 ; sheet SA/OB2_1  [a separate net that carries the same name]
SG_A: port SG_A, sheet SA/STALLGUARD
SG_B: port SG_B, sheet SB/STALLGUARD
SG_C: port SG_C, sheet SC/STALLGUARD
SG_X: port SG_X, sheet SX/STALLGUARD
SG_Y: port SG_Y, sheet SY/STALLGUARD
SG_Z: port SG_Z, sheet SZ/STALLGUARD
STEP_A: port STEP_A, sheet SA/STEP
STEP_B: port STEP_B, sheet SB/STEP
STEP_C: port STEP_C, sheet SC/STEP
STEP_X: port STEP_X, sheet SX/STEP
STEP_Y: port STEP_Y, sheet SY/STEP
STEP_Z: port STEP_Z, sheet SZ/STEP
STP_SCK: sheet AO/VIA, port SPI_CONFIG.SPI_CLK  [project net SPI_MOTOR.SPI_CLK]
STP_SCK_5V: sheet SX/SCK, sheet SY/SCK, sheet SZ/SCK, sheet SA/SCK, sheet SB/SCK, sheet SC/SCK, sheet AO/VOA
STP_SDI: sheet AO/VIB, port SPI_CONFIG.SPI_PICO  [project net SPI_MOTOR.SPI_PICO]
STP_SDI_5V: sheet SX/SDI, sheet SY/SDI, sheet SZ/SDI, sheet SA/SDI, sheet SB/SDI, sheet SC/SDI, sheet AO/VOB
STP_SDO: sheet AO/VOA, port SPI_CONFIG.SPI_POCI  [project net SPI_MOTOR.SPI_POCI]
STP_SDO_5V: sheet SX/SDO, sheet SY/SDO, sheet SZ/SDO, sheet SA/SDO, sheet SB/SDO, sheet SC/SDO, sheet AO/VIA

### Notes on the sheet
- Stepper Drivers
- SHEET
- Expatria Technologies
- 1136 Glade Court
- Port Coquitlam, BC V3B 1R5
- PROJECT
- SIZE
- ENGR
- MODIFIED
- DOCUMENT
- REV
- Copyright Expatria Technologies 2023. This document describes Open Hardware and is licensed under the CERN-OHL-S v2. No warranty is implied or expressed.
- EMAIL: INFO@EXPATRIA.CA
- B
- /

### Library data of the parts
C9 = 0603 100nF (104) 10% 50V: Chip capacitors; Manufacturer: YAGEO; PartNumber: CC0603KRX7R9BB104; Tolerance: 10%; Voltage: 50V; ComponentLink1Description: Supplier link; ComponentLink1URL: http://www.szlcsc.com/product/details_15331.html; Package: 0603; Supplier: LC; SuppliersPartNumber: C14663; Capacitance: 100nF
P4 P30-P34 = WJ2EDGVC-5.08-4P: 4 Straight pin 1 5.08mm Green Board Edge/Receptacle-Close Straight,P=5.08mm Pluggable System Terminal Block ROHS; Manufacturer: Ningbo Kangnex Elec; Supplier Part Number 1: C8436; Manufacturer Part Number: WJ2EDGVC-5.08-4P; RoHS: Yes; Category: Terminals; SuppliersPartNumber: C8436; Supplier 1: LCSC

## Sheet Stepper_Driver_Quark.SchDoc: RP2040 CNC
size B; Author: AM; CompanyName: Expatria Technologies; DrawnBy: A.Marles; Engineer: AM; Organization: Expatria Technolgoies; Address1: 1136 Glade Court; Address3: Port Coquitlam, BC V3B 1R5; Address4: Canada; DocumentNumber: 12; Revision: A1; SheetNumber: 12; SheetTotal: 30
Used 6 times, as channels STM32F446 CNC Controller/ST/SX, STM32F446 CNC Controller/ST/SY, STM32F446 CNC Controller/ST/SZ, STM32F446 CNC Controller/ST/SA, STM32F446 CNC Controller/ST/SB, STM32F446 CNC Controller/ST/SC. Parts and nets are listed once, with the designators drawn on the sheet.
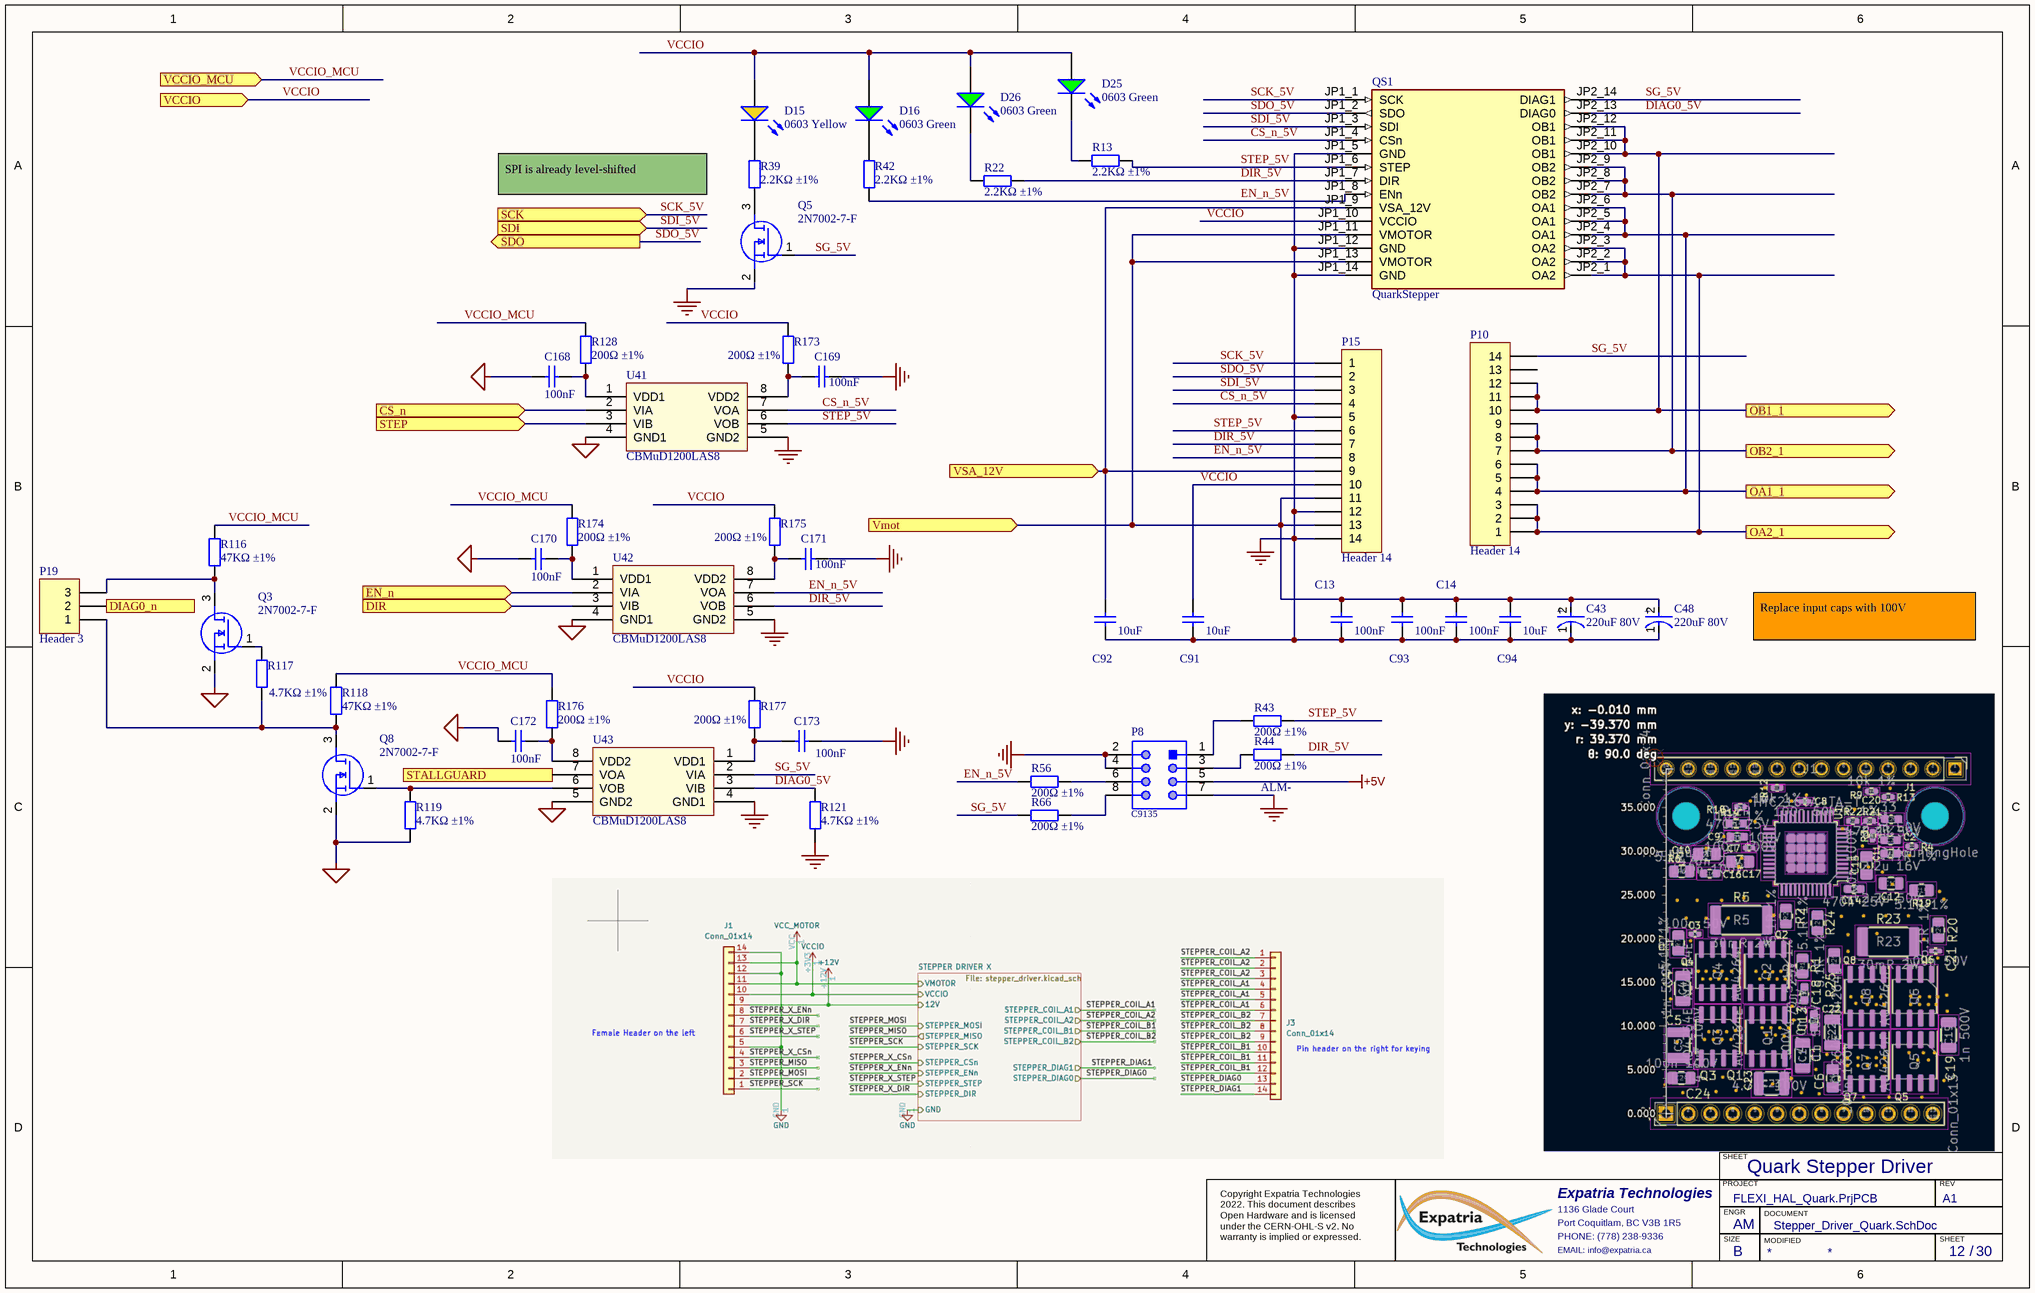
[diagram p3: Stepper_Driver_Quark.SchDoc]

### Parts
C13  100nF  [0603_C]
C14  100nF  [0603_C]
C43  220uF 80V  [FP-RAD-TH-D_10_0_5-L_20_2-MFG]
C48  220uF 80V  [FP-RAD-TH-D_10_0_5-L_20_2-MFG]
C91  10uF  [0805_C]
C92  10uF  [0805_C]
C93  100nF  [0603_C]
C94  10uF  [0805_C]
C168  100nF  [0603_C]
C169  100nF  [0603_C]
C170  100nF  [0603_C]
C171  100nF  [0603_C]
C172  100nF  [0603_C]
C173  100nF  [0603_C]
D15  0603 Yellow  [0603_LED_S1]
D16  0603 Green  [0603_LED_S1]
D25  0603 Green  [0603_LED_S1]
D26  0603 Green  [0603_LED_S1]
P8  C9135  [61200821621]
P10  Header 14  [HDR1X14]
P15  Header 14  [HDR1X14]
P19  Header 3  [HDR1X3]
Q3  2N7002-7-F  [SOT-23(SOT-23-3)]
Q5  2N7002-7-F  [SOT-23(SOT-23-3)]
Q8  2N7002-7-F  [SOT-23(SOT-23-3)]
QS1  QuarkStepper  [QuarkStepperDriver]
R13  2.2KΩ ±1%  [0603_R]
R22  2.2KΩ ±1%  [0603_R]
R39  2.2KΩ ±1%  [0603_R]
R42  2.2KΩ ±1%  [0603_R]
R43  200Ω ±1%  [0603_R]
R44  200Ω ±1%  [0603_R]
R56  200Ω ±1%  [0603_R]
R66  200Ω ±1%  [0603_R]
R116  47KΩ ±1%  [0603_R]
R117  4.7KΩ ±1%  [0603_R]
R118  47KΩ ±1%  [0603_R]
R119  4.7KΩ ±1%  [0603_R]
R121  4.7KΩ ±1%  [0603_R]
R128  200Ω ±1%  [0603_R]
R173  200Ω ±1%  [0603_R]
R174  200Ω ±1%  [0603_R]
R175  200Ω ±1%  [0603_R]
R176  200Ω ±1%  [0603_R]
R177  200Ω ±1%  [0603_R]
U41  CBMuD1200LAS8  [SOIC-8_150mil]
U42  CBMuD1200LAS8  [SOIC-8_150mil]
U43  CBMuD1200LAS8  [SOIC-8_150mil]

### Ports
CS_n (in), DIAG0_n (out), DIR (in), EN_n (in), OA1_1 (out), OA2_1 (out), OB1_1 (out), OB2_1 (out), SCK (in), SDI (in), SDO (out), STALLGUARD (out), STEP (in), VCCIO (in), VCCIO_MCU (in), Vmot (in), VSA_12V (in)

### Nets
+5V: P8.5
GND: C13.2 C14.2 C43.1(C) C48.1(C) C91.1 C92.1 C93.2 C94.1 C169.1 C171.1 C173.2 P8.2 P8.4 P8.7 P15.5 P15.12 P15.14 Q5.2(S) QS1.JP1_5(GND) QS1.JP1_12(GND) QS1.JP1_14(GND) R121.1 U41.5(GND2) U42.5(GND2) U43.4(GND1)
MCU_GND: C168.2 C170.2 C172.1 Q3.2(S) Q8.2(S) R119.1 U41.4(GND1) U42.4(GND1) U43.5(GND2)
CS_n: U41.2(VIA) ; port CS_n
CS_n_5V: P15.4 QS1.JP1_4(CSn) U41.7(VOA)
DIAG0_5V: QS1.JP2_13(DIAG0) R121.2 U43.3(VIB)
DIAG0_n: P19.2 ; port DIAG0_n
DIR: U42.3(VIB) ; port DIR
DIR_5V: P15.7 QS1.JP1_7(DIR) R22.1 R44.1 U42.6(VOB)
EN_n: U42.2(VIA) ; port EN_n
EN_n_5V: P15.8 QS1.JP1_8(ENn) R42.1 R56.2 U42.7(VOA)
OA1_1: P10.4 P10.5 P10.6 QS1.JP2_4(OA1) QS1.JP2_5(OA1) QS1.JP2_6(OA1) ; port OA1_1
OA2_1: P10.1 P10.2 P10.3 QS1.JP2_1(OA2) QS1.JP2_2(OA2) QS1.JP2_3(OA2) ; port OA2_1
OB1_1: P10.10 P10.11 P10.12 QS1.JP2_10(OB1) QS1.JP2_11(OB1) QS1.JP2_12(OB1) ; port OB1_1
OB2_1: P10.7 P10.8 P10.9 QS1.JP2_7(OB2) QS1.JP2_8(OB2) QS1.JP2_9(OB2) ; port OB2_1
SCK_5V: P15.1 QS1.JP1_1(SCK) ; port SCK
SDI_5V: P15.3 QS1.JP1_3(SDI) ; port SDI
SDO_5V: P15.2 QS1.JP1_2(SDO) ; port SDO
SG_5V: P10.14 Q5.1(G) QS1.JP2_14(DIAG1) R66.2 U43.2(VIA)
STALLGUARD: U43.7(VOA) ; port STALLGUARD
STEP: U41.3(VIB) ; port STEP
STEP_5V: P15.6 QS1.JP1_6(STEP) R13.1 R43.1 U41.6(VOB)
VCCIO: C91.2 D15.A D16.A D25.A D26.A P15.10 QS1.JP1_10(VCCIO) R173.2 R175.2 R177.2 ; port VCCIO
VCCIO_MCU: R116.2 R118.2 R128.2 R174.2 R176.2 ; port VCCIO_MCU
Vmot: C13.1 C14.1 C43.2(A) C48.2(A) C93.1 C94.2 P15.11 P15.13 QS1.JP1_11(VMOTOR) QS1.JP1_13(VMOTOR) ; port Vmot
VSA_12V: C92.2 P15.9 QS1.JP1_9(VSA_12V) ; port VSA_12V
NetC168_1: C168.1 R128.1 U41.1(VDD1)
NetC169_2: C169.2 R173.1 U41.8(VDD2)
NetC170_1: C170.1 R174.1 U42.1(VDD1)
NetC171_2: C171.2 R175.1 U42.8(VDD2)
NetC172_2: C172.2 R176.1 U43.8(VDD2)
NetC173_1: C173.1 R177.1 U43.1(VDD1)
NetD15_K: D15.K R39.2
NetD16_K: D16.K R42.2
NetD25_K: D25.K R13.2
NetD26_K: D26.K R22.2
NetP8_1: P8.1 R43.2
NetP8_3: P8.3 R44.2
NetP8_6: P8.6 R56.1
NetP8_8: P8.8 R66.1
NetP19_1: P19.1 Q8.3(D) R117.1 R118.1
NetP19_3: P19.3 Q3.3(D) R116.1
NetQ3_1: Q3.1(G) R117.2
NetQ5_3: Q5.3(D) R39.1
NetQ8_1: Q8.1(G) R119.2 U43.6(VOB)

Not connected (* = marked no-connect by the designer): P10 13

### Channels
STM32F446 CNC Controller/ST/SX: designators end in _SX; ports CS_n=CS_X DIAG0_n=HALT_n DIR=DIR_X EN_n=ENN_X OA1_1=OA1_1 OA2_1=OA2_1 OB1_1=OB1_1 OB2_1=OB2_1 SCK=STP_SCK_5V SDI=STP_SDI_5V SDO=STP_SDO_5V STALLGUARD=SG_X STEP=STEP_X VCCIO=+5V VCCIO_MCU=+3.3V Vmot=MOTOR_VCC_48V VSA_12V=+12V
STM32F446 CNC Controller/ST/SY: designators end in _SY; ports CS_n=CS_Y DIAG0_n=HALT_n DIR=DIR_Y EN_n=ENN_Y OA1_1=OA1_1 OA2_1=OA2_1 OB1_1=OB1_1 OB2_1=OB2_1 SCK=STP_SCK_5V SDI=STP_SDI_5V SDO=STP_SDO_5V STALLGUARD=SG_Y STEP=STEP_Y VCCIO=+5V VCCIO_MCU=+3.3V Vmot=MOTOR_VCC_48V VSA_12V=+12V
STM32F446 CNC Controller/ST/SZ: designators end in _SZ; ports CS_n=CS_Z DIAG0_n=HALT_n DIR=DIR_Z EN_n=ENN_Z OA1_1=OA1_1 OA2_1=OA2_1 OB1_1=OB1_1 OB2_1=OB2_1 SCK=STP_SCK_5V SDI=STP_SDI_5V SDO=STP_SDO_5V STALLGUARD=SG_Z STEP=STEP_Z VCCIO=+5V VCCIO_MCU=+3.3V Vmot=MOTOR_VCC_48V VSA_12V=+12V
STM32F446 CNC Controller/ST/SA: designators end in _SA; ports CS_n=CS_A DIAG0_n=HALT_n DIR=DIR_A EN_n=ENN_A OA1_1=OA1_1 OA2_1=OA2_1 OB1_1=OB1_1 OB2_1=OB2_1 SCK=STP_SCK_5V SDI=STP_SDI_5V SDO=STP_SDO_5V STALLGUARD=SG_A STEP=STEP_A VCCIO=+5V VCCIO_MCU=+3.3V Vmot=MOTOR_VCC_48V VSA_12V=+12V
STM32F446 CNC Controller/ST/SB: designators end in _SB; ports CS_n=CS_B DIAG0_n=HALT_n DIR=DIR_B EN_n=ENN_B OA1_1=OA1_1 OA2_1=OA2_1 OB1_1=OB1_1 OB2_1=OB2_1 SCK=STP_SCK_5V SDI=STP_SDI_5V SDO=STP_SDO_5V STALLGUARD=SG_B STEP=STEP_B VCCIO=+5V VCCIO_MCU=+3.3V Vmot=MOTOR_VCC_48V VSA_12V=+12V
STM32F446 CNC Controller/ST/SC: designators end in _SC; ports CS_n=CS_C DIAG0_n=HALT_n DIR=DIR_C EN_n=ENN_C OA1_1=OA1_1 OA2_1=OA2_1 OB1_1=OB1_1 OB2_1=OB2_1 SCK=STP_SCK_5V SDI=STP_SDI_5V SDO=STP_SDO_5V STALLGUARD=SG_C STEP=STEP_C VCCIO=+5V VCCIO_MCU=+3.3V Vmot=MOTOR_VCC_48V VSA_12V=+12V

### Notes on the sheet
- SPI is already level-shifted
- Replace input caps with 100V
- (near R44) ALM-
- Quark Stepper Driver
- SHEET
- Expatria Technologies
- 1136 Glade Court
- Port Coquitlam, BC V3B 1R5
- PHONE: (778) 238-9336
- PROJECT
- SIZE
- ENGR
- MODIFIED
- DOCUMENT
- REV
- Copyright Expatria Technologies 2022. This document describes Open Hardware and is licensed under the CERN-OHL-S v2. No warranty is implied or expressed.
- EMAIL: info@expatria.ca
- B
- /
- (in symbol CMP-05427-001274-1) +

### Library data of the parts
C13 C14 C93 = 0603 100nF (104) 10% 50V: Chip capacitors; Manufacturer: YAGEO; Manufacturer Part Number: CC0603KRX7R9BB104; Tolerance: 10%; Voltage: 50V; ComponentLink1Description: Supplier link; ComponentLink1URL: http://www.szlcsc.com/product/details_15331.html; Package: 0603; Supplier: LCSC; SuppliersPartNumber: C14663; Capacitance: 100nF
C43 C48 = CMP-05427-001274-1: Aluminum Electrolytic Capacitors (Radial Lead Type) AEC-Q200 Qualified 820uF ±20% 25V; Dielectric Material: Aluminium; Ripple Current: 1.49A; Dissipation Factor: 0.14%; Life (Hours): 4000Hour; Lead/Base Style: Straight; Lead Diameter: 0.6mm; Termination: Radial; Construction: RADIAL; Lead Pitch: 5mm; Series: FK; Voltage Rating: 25V; Length: 20mm; Max Operating Temperature: 105°C; Tolerance: 20%; REACH SVHC: No SVHC; Radiation Hardening: No; Voltage: 25V; Voltage Rating (DC): 25V; Mount: Through Hole; Capacitance: 820uF; Case/Package: Radial; Min Operating Temperature: -55°C; Package Quantity: 200; Diameter: 10mm; Packaging: Tape and Reel; Height: 20mm
C91 C92 C94 = 0805 10uF (106) 10% 25V: Chip capacitors; Manufacturer: Samsung Electro-Mechanics; PartNumber: CL21A106KAYNNNE; Tolerance: 10%; Voltage: 25V; ComponentLink1Description: Supplier link; ComponentLink1URL: http://www.szlcsc.com/product/details_16532.html; Package: 0805; Supplier: LCSC; SuppliersPartNumber: C15850; Capacitance: 10uF; Manufacturer Part Number: CL21A106KAYNNNE
C168-C173 = 0603 100nF (104) 10% 50V: as C9 on sheet Stepper_driver_group; ComponentLink1Description: Supplier link; ComponentLink1URL: http://www.szlcsc.com/product/details_15331.html; Package: 0603; Supplier: LC; SuppliersPartNumber: C14663; Capacitance: 100nF
D15 = 0603 LED Yellow: LED; ComponentLink1Description: 供应商链接; ComponentLink1URL: http://www.szlcsc.com/product/details_73147.html; Package: 0603; Supplier: LC; SuppliersPartNumber: C72038; Color: Yellow
D16 D25 D26 = 0603 LED Green: LED; ComponentLink1Description: 供应商链接; ComponentLink1URL: http://www.szlcsc.com/product/details_73152.html; Package: 0603; Supplier: LC; SuppliersPartNumber: C72043; Color: Green
P8 = CMP-1502-00006-1: Male Box Header WR-BHD, THT, Vertical, pitch 2.54 mm, 8 pins; Manufacturer: Wurth Elektronik; Pitch: 2.54mm; Publisher: WurthElektronik; Part Number: C9135; Packaging: Tray; Published Date: August2018; Package Reference: 61200821621; SuppliersPartNumber: C9135
P10 = Header 14: Header, 14-Pin; LatestRevisionDate: 17-Jul-2002; LatestRevisionNote: Re-released for DXP Platform.; Publisher: Altium Limited; SuppliersPartNumber: C2894937
P15 = Header 14: Socket, 14-Pin; LatestRevisionDate: 17-Jul-2002; LatestRevisionNote: Re-released for DXP Platform.; Publisher: Altium Limited; SuppliersPartNumber: C2897377
P19 = Header 3: Header, 3-Pin; Publisher: Altium Limited; SuppliersPartNumber: C49257
Q3 Q5 Q8 = 2N7002-7-F: 60V 115mA 7.5Ω@5V,50mA 370mW N Channel SOT-23 MOSFETs ROHS; Manufacturer: Diodes Inc.; SuppliersPartNumber: C85049; Manufacturer Part Number: 2N7002-7-F; Value: 2N7002-7-F; Datasheet Link: https://datasheet.datasheetarchive.com/originals/distributors/SFDatasheet-0/sf-0003625.pdf; Height: 1.2mm; Manufacturer_Part_Number: 2N7002-7-F; Mouser Part Number: 621-2N7002-F; Mouser Price/Stock: https://www.mouser.co.uk/ProductDetail/Diodes-Incorporated/2N7002-7-F?qs=jMXWnm70%252BC%252BAX%252BMLzUkTZg%3D%3D; Arrow Part Number: 2N7002-7-F; Arrow Price/Stock: https://www.arrow.com/en/products/2n7002-7-f/diodes-incorporated?region=nac
QS1 = Quark_2160: Open source TMC2160 module; MF: Trinamic Motion; MP: TMC2208 SILENTSTEPSTICK; Digi-Key_Part_Number: 1460-TMC2208SILENTSTEPSTICK-ND; SnapEDA_Link: https://www.snapeda.com/parts/TMC2208%20SILENTSTEPSTICK/Trinamic+Motion+Control+GmbH/view-part/?ref=snap; Purchase-URL: https://pricing.snapeda.com/search/part/TMC2208 SILENTSTEPSTICK/?ref=eda; Package: None; Check_prices: https://www.snapeda.com/parts/TMC2208%20SILENTSTEPSTICK/Trinamic+Motion+Control+GmbH/view-part/?ref=eda; Value: *
R13 R22 R39 R42 = 0603 2.2K (2201) 1%: Chip resistor; Manufacturer: Uniroyal Elec; PartNumber: 0603WAF2201T5E; Power: 1/10W; ComponentLink1Description: Supplier link; ComponentLink1URL: http://www.szlcsc.com/product/details_4597.html; Package: 0603; Supplier: LC; SuppliersPartNumber: C4190; Resistance: 2.2KΩ; Tolerance: 1%
R43 R44 R56 R66 R128 R173-R177 = 0603 200R (2000) 1%: Chip resistor; Manufacturer: Uniroyal Elec; PartNumber: 0603WAF2000T5E; Power: 1/10W; ComponentLink1Description: Supplier link; ComponentLink1URL: http://www.szlcsc.com/product/details_8708.html; Package: 0603; Supplier: LC; SuppliersPartNumber: C8218; Resistance: 200Ω; Tolerance: 1%
R116 R118 = 0603 47K (4702) 1%: Chip resistor; Manufacturer: Uniroyal Elec; PartNumber: 0603WAF4702T5E; Power: 1/10W; ComponentLink1Description: Supplier link; ComponentLink1URL: http://www.szlcsc.com/product/details_26562.html; Package: 0603; Supplier: LC; SuppliersPartNumber: C25819; Resistance: 47KΩ; Tolerance: 1%
R117 R119 R121 = 0603 4.7K (4701) 1%: as R133 on sheet Flexi_Quark_board; ComponentLink1Description: Supplier link; ComponentLink1URL: http://www.szlcsc.com/product/details_23889.html; Package: 0603; Supplier: LC; SuppliersPartNumber: C23162; Resistance: 4.7KΩ; Tolerance: 1%
U41-U43 = CBMuD1200LAS8: Dual Channel Isolator; Package: SOIC-8_150mil; Supplier: LC; SuppliersPartNumber: C476470; ComponentLink1Description: 供应商链接; ComponentLink1URL: http://www.szlcsc.com/product/details_10199.html